# Altium project ESPedal.PrjPcb
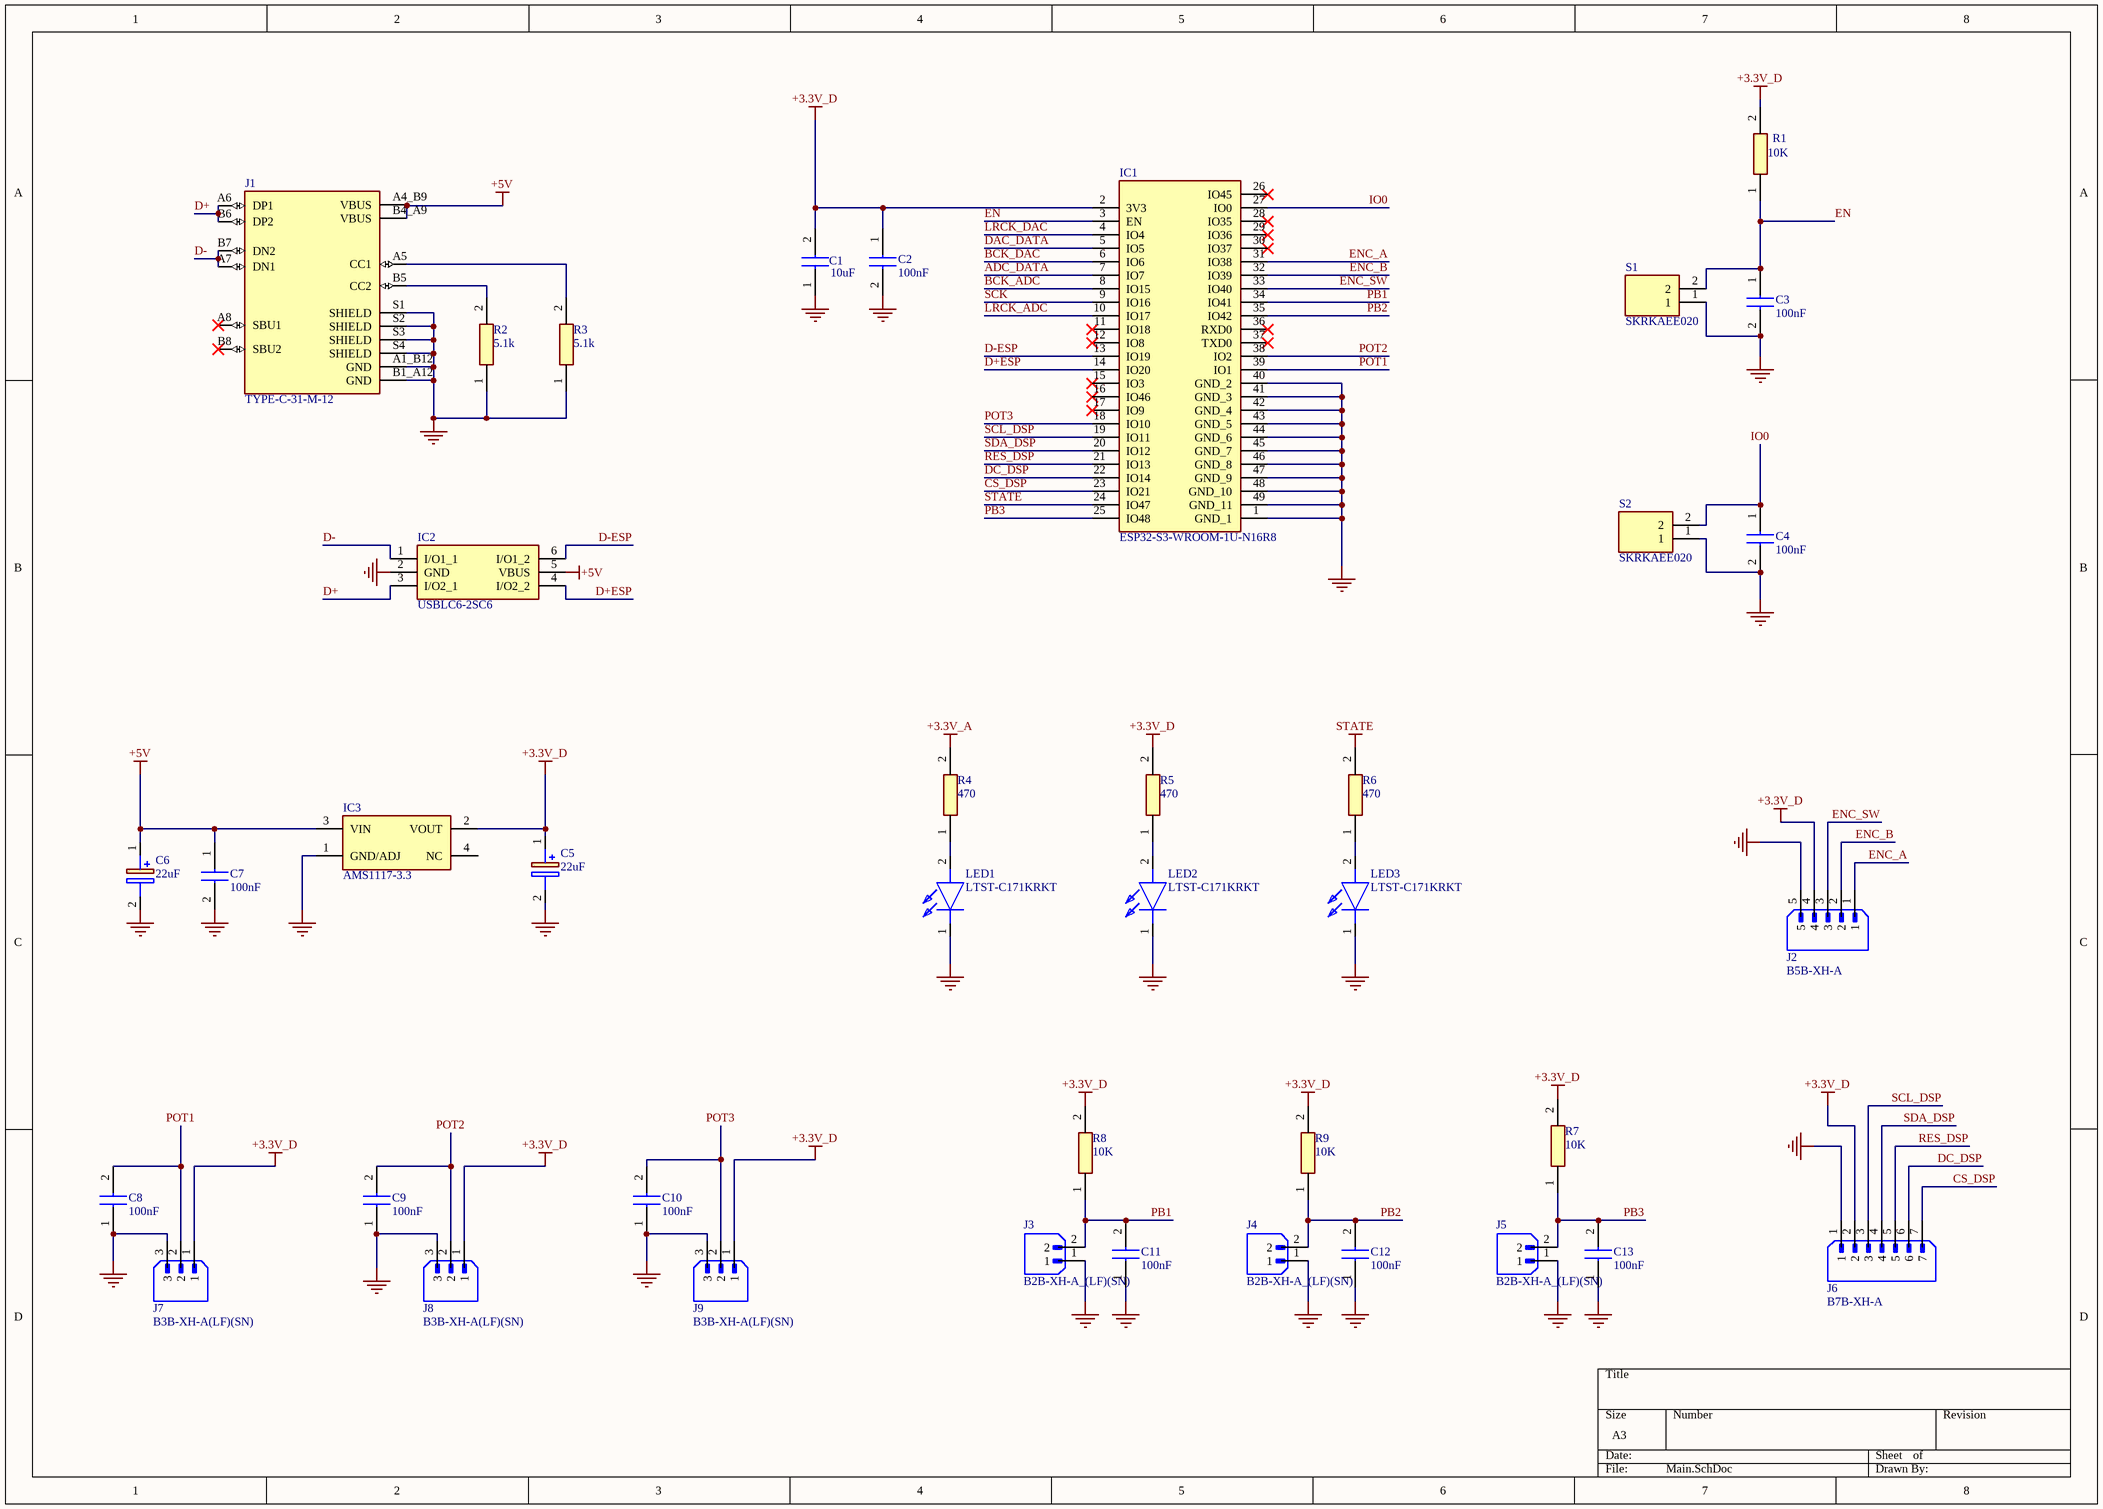
[diagram p0: Main.SchDoc]
2 sheets, 109 parts. Net scope: global (net labels, ports and power ports of the same name join across sheets).
Board file: PCB.PcbDoc
Sheets:
  Main.SchDoc
  Mixed.SchDoc

## Sheet Main.SchDoc
size A3; SheetNumber: 1; SheetTotal: 2

### Parts
C1  10uF  [CAPC3216X180N]
C2  100nF  [CAPC1608X90N]
C3  100nF  [CAPC1608X90N]
C4  100nF  [CAPC1608X90N]
C5  22uF  [CAPAE430X590N]
C6  22uF  [CAPAE430X590N]
C7  100nF  [CAPC1608X90N]
C8  100nF  [CAPC1608X90N]
C9  100nF  [CAPC1608X90N]
C10  100nF  [CAPC1608X90N]
C11  100nF  [CAPC1608X90N]
C12  100nF  [CAPC1608X90N]
C13  100nF  [CAPC1608X90N]
IC1  ESP32-S3-WROOM-1U-N16R8  [ESP32S3WROOM1UN16R8]
IC2  USBLC6-2SC6  [SOT95P280X145-6N]
IC3  AMS1117-3.3  [SOT229P700X180-4N]
J1  TYPE-C-31-M-12  [HRO_TYPE-C-31-M-12]
J2  B5B-XH-A  [JST_B5B-XH-A]  (no BOM)
J3  B2B-XH-A_(LF)(SN)  [JST_B2B-XH-A_(LF)(SN)]  (no BOM)
J4  B2B-XH-A_(LF)(SN)  [JST_B2B-XH-A_(LF)(SN)]  (no BOM)
J5  B2B-XH-A_(LF)(SN)  [JST_B2B-XH-A_(LF)(SN)]  (no BOM)
J6  B7B-XH-A  [JST_B7B-XH-A]  (no BOM)
J7  B3B-XH-A(LF)(SN)  [JST_B3B-XH-A(LF)(SN)]  (no BOM)
J8  B3B-XH-A(LF)(SN)  [JST_B3B-XH-A(LF)(SN)]  (no BOM)
J9  B3B-XH-A(LF)(SN)  [JST_B3B-XH-A(LF)(SN)]  (no BOM)
LED1  LTST-C171KRKT  [LEDM2012X90N]
LED2  LTST-C171KRKT  [LEDM2012X90N]
LED3  LTST-C171KRKT  [LEDM2012X90N]
R1  10K  [RESC2012X60N]
R2  5.1k  [ERA6AEB101V]
R3  5.1k  [ERA6AEB101V]
R4  470  [ERA3AEB101V]
R5  470  [ERA3AEB101V]
R6  470  [ERA3AEB101V]
R7  10K  [RESC2012X60N]
R8  10K  [RESC2012X60N]
R9  10K  [RESC2012X60N]
S1  SKRKAEE020  [SKRKAEE020]
S2  SKRKAEE020  [SKRKAEE020]

### Nets
+3.3V_A: R4.2
+3.3V_D: C1.2 C2.1 C5.1(+) IC1.2(3V3) IC3.2(VOUT) J2.4 J6.2 J7.1 J8.1 J9.1 R1.2 R5.2 R7.2 R8.2 R9.2
+5V: C6.1(+) C7.1 IC2.5(VBUS) IC3.3(VIN) J1.A4_B9(VBUS) J1.B4_A9(VBUS)
GND: C1.1 C2.2 C3.2 C4.2 C5.2(-) C6.2(-) C7.2 C8.1 C9.1 C10.1 C11.1 C12.1 C13.1 IC1.1(GND_1) IC1.40(GND_2) IC1.41(GND_3) IC1.42(GND_4) IC1.43(GND_5) IC1.44(GND_6) IC1.45(GND_7) IC1.46(GND_8) IC1.47(GND_9) IC1.48(GND_10) IC1.49(GND_11) IC2.2(GND) IC3.1(GND/ADJ) J1.A1_B12(GND) J1.B1_A12(GND) J1.S1(SHIELD) J1.S2(SHIELD) J1.S3(SHIELD) J1.S4(SHIELD) J2.5 J3.1 J4.1 J5.1 J6.1 J7.3 J8.3 J9.3 LED1.1(K) LED2.1(K) LED3.1(K) R2.1 R3.1 S1.1 S2.1
STATE: IC1.24(IO47) R6.2
ADC_DATA: IC1.7(IO7)
BCK_ADC: IC1.8(IO15)
BCK_DAC: IC1.6(IO6)
CS_DSP: IC1.23(IO21) J6.7
D+: IC2.3(I/O2_1) J1.A6(DP1) J1.B6(DP2)
D+ESP: IC1.14(IO20) IC2.4(I/O2_2)
D-: IC2.1(I/O1_1) J1.A7(DN1) J1.B7(DN2)
D-ESP: IC1.13(IO19) IC2.6(I/O1_2)
DAC_DATA: IC1.5(IO5)
DC_DSP: IC1.22(IO14) J6.6
EN: C3.1 IC1.3(EN) R1.1 S1.2
ENC_A: IC1.31(IO38) J2.1
ENC_B: IC1.32(IO39) J2.2
ENC_SW: IC1.33(IO40) J2.3
IO0: C4.1 IC1.27(IO0) S2.2
LRCK_ADC: IC1.10(IO17)
LRCK_DAC: IC1.4(IO4)
PB1: C11.2 IC1.34(IO41) J3.2 R8.1
PB2: C12.2 IC1.35(IO42) J4.2 R9.1
PB3: C13.2 IC1.25(IO48) J5.2 R7.1
POT1: C8.2 IC1.39(IO1) J7.2
POT2: C9.2 IC1.38(IO2) J8.2
POT3: C10.2 IC1.18(IO10) J9.2
RES_DSP: IC1.21(IO13) J6.5
SCK: IC1.9(IO16)
SCL_DSP: IC1.19(IO11) J6.3
SDA_DSP: IC1.20(IO12) J6.4
NetJ1_A5: J1.A5(CC1) R3.2
NetJ1_B5: J1.B5(CC2) R2.2
NetLED1_2: LED1.2(A) R4.1
NetLED2_2: LED2.2(A) R5.1
NetLED3_2: LED3.2(A) R6.1

Not connected (* = marked no-connect by the designer): IC1 11(IO18)* 12(IO8)* 15(IO3)* 16(IO46)* 17(IO9)* 26(IO45)* 28(IO35)* 29(IO36)* 30(IO37)* 36(RXD0)* 37(TXD0)*; IC3 4(NC); J1 A8(SBU1)* B8(SBU2)*

### Library data of the parts
C1 = CL31A106KAHNNNE: Capacitor; Manufacturer_Name: SAMSUNG; Datasheet Link: https://datasheet.datasheetarchive.com/originals/distributors/Datasheets_SAMA/8c86add0e95aa125c91e23e767429ce6.pdf; Height: 1.8mm; Manufacturer_Part_Number: CL31A106KAHNNNE; Mouser Part Number: 187-CL31A106KAHNNNE; Mouser Price/Stock: https://www.mouser.co.uk/ProductDetail/Samsung-Electro-Mechanics/CL31A106KAHNNNE?qs=349EhDEZ59rSHw4%2FqTnHBg%3D%3D; Arrow Part Number: CL31A106KAHNNNE; Arrow Price/Stock: https://www.arrow.com/en/products/cl31a106kahnnne/samsung-electro-mechanics?utm_currency=USD&region=europe
C2-C4 C7-C13 = CL10B104KC8NNNC: Capacitor; Manufacturer_Name: SAMSUNG; Datasheet Link: https://datasheet.datasheetarchive.com/originals/distributors/DKDS-19/373511.pdf; Height: 0.9mm; Manufacturer_Part_Number: CL10B104KC8NNNC; Mouser Part Number: 187-CL10B104KC8NNNC; Mouser Price/Stock: https://www.mouser.co.uk/ProductDetail/Samsung-Electro-Mechanics/CL10B104KC8NNNC?qs=%2FukktrhNKsY5bKXvqblW4Q%3D%3D; Arrow Part Number: CL10B104KC8NNNC; Arrow Price/Stock: https://www.arrow.com/en/products/cl10b104kc8nnnc/samsung-electro-mechanics?utm_currency=USD&region=europe
C5 C6 = RVT1C220M0405: Capacitor Polarised; Manufacturer_Name: ROQANG; Datasheet Link: https://wmsc.lcsc.com/wmsc/upload/file/pdf/v2/lcsc/2304140030_CX-Dongguan-Chengxing-Elec-RVT1C220M0405_C81984.pdf; Height: 5.9mm; Manufacturer_Part_Number: RVT1C220M0405
IC1 = ESP32-S3-WROOM-1U-N16R8: Integrated Circuit; Manufacturer_Name: Espressif Systems; Datasheet Link: https://www.espressif.com/sites/default/files/documentation/esp32-s3-wroom-1_wroom-1u_datasheet_en.pdf; Height: 3.35mm; Manufacturer_Part_Number: ESP32-S3-WROOM-1U-N16R8; Mouser Part Number: 356-ESP32S3WM1UN16R8; Mouser Price/Stock: https://www.mouser.co.uk/ProductDetail/Espressif-Systems/ESP32-S3-WROOM-1U-N16R8?qs=Li%252BoUPsLEns6V0Pr5KRJtw%3D%3D
IC2 = USBLC6-2SC6: Integrated Circuit; Manufacturer_Name: STMicroelectronics; Datasheet Link: https://www.st.com/resource/en/datasheet/usblc6-2.pdf; Height: 1.45mm; Manufacturer_Part_Number: USBLC6-2SC6; Mouser Part Number: 511-USBLC6-2SC6; Mouser Price/Stock: https://www.mouser.co.uk/ProductDetail/STMicroelectronics/USBLC6-2SC6?qs=po45yt2pPpu%2FhNIlwQdTlg%3D%3D; Arrow Part Number: USBLC6-2SC6; Arrow Price/Stock: https://www.arrow.com/en/products/usblc6-2sc6/stmicroelectronics.html?utm_currency=USD&region=nac
IC3 = AMS1117-3.3: Integrated Circuit; Manufacturer_Name: Advanced; Datasheet Link: https://datasheet.datasheetarchive.com/originals/distributors/Datasheets-28/DSA-550594.pdf; Height: 1.8mm; Manufacturer_Part_Number: AMS1117-3.3
J1 = TYPE-C-31-M-12: USB Connectors 24 Receptacle 1 8.94*7.3mm RoHS; MF: HRO Electronics Co., Ltd.; SnapEDA_Link: https://www.snapeda.com/parts/TYPE-C-31-M-12/HRO+Electronics+Co.%252C+Ltd./view-part/?ref=snap; Package: Package; Value: *; MP: TYPE-C-31-M-12; Check_prices: https://www.snapeda.com/parts/TYPE-C-31-M-12/HRO+Electronics+Co.%252C+Ltd./view-part/?ref=eda; Manufacturer_Part_Number: TYPE-C-31-M-12
J2 = B5B-XH-A: Connector Header Through Hole 5 position 0.098 (2.50mm); MF: JST Sales; SnapEDA_Link: https://www.snapeda.com/parts/B5B-XH-A/JST+Sales+America+Inc./view-part/?ref=snap; Package: None; Value: *; MP: B5B-XH-A; Check_prices: https://www.snapeda.com/parts/B5B-XH-A/JST+Sales+America+Inc./view-part/?ref=eda
J3-J5 = B2B-XH-A_(LF)(SN): Connector Header Through Hole 2 position 0.098 (2.50mm); MF: JST Sales; MP: B2B-XH-A (LF)(SN); SnapEDA_Link: https://www.snapeda.com/parts/B2B-XH-A%20(LF)(SN)/JST+Sales+America+Inc./view-part/?ref=snap; Package: None; Value: *; Check_prices: https://www.snapeda.com/parts/B2B-XH-A%20(LF)(SN)/JST+Sales+America+Inc./view-part/?ref=eda
J6 = B7B-XH-A: Connector Header Through Hole 7 position 0.098 (2.50mm); MF: JST Sales; SnapEDA_Link: https://www.snapeda.com/parts/B7B-XH-A/JST+Sales+America+Inc./view-part/?ref=snap; Package: None; Value: *; MP: B7B-XH-A; Check_prices: https://www.snapeda.com/parts/B7B-XH-A/JST+Sales+America+Inc./view-part/?ref=eda
J7-J9 = B3B-XH-A(LF)(SN): Connector Header Through Hole 3 position 0.098 (2.50mm); MF: JST Sales; SnapEDA_Link: https://www.snapeda.com/parts/B3B-XH-A(LF)(SN)/JST/view-part/?ref=snap; Package: None; Value: *; MP: B3B-XH-A(LF)(SN); Check_prices: https://www.snapeda.com/parts/B3B-XH-A(LF)(SN)/JST/view-part/?ref=eda
LED1-LED3 = LTST-C171KRKT: LED; Manufacturer_Name: Lite-On; Datasheet Link: http://www.mouser.com/datasheet/2/239/Lite-On-LTST-C171KRKT-1175280.pdf; Height: 0.9mm; Manufacturer_Part_Number: LTST-C171KRKT; Mouser Part Number: 859-LTST-C171KRKT; Mouser Price/Stock: https://www.mouser.co.uk/ProductDetail/LITEON/LTST-C171KRKT?qs=5XMAZBf2SiSTcAb1f5vDzw%3D%3D; Arrow Part Number: LTST-C171KRKT; Arrow Price/Stock: https://www.arrow.com/en/products/ltst-c171krkt/lite-on-technology?utm_currency=USD&region=nac
R1 R7-R9 = AC0805JR-0710KL: Resistor; Manufacturer_Name: Yageo Group; Datasheet Link: https://www.yageo.com/upload/media/product/productsearch/datasheet/rchip/PYu-AC_51_RoHS_L_10.pdf; Height: 0.6mm; Manufacturer_Part_Number: AC0805JR-0710KL; Mouser Part Number: 603-AC0805JR-0710KL; Mouser Price/Stock: https://www.mouser.co.uk/ProductDetail/YAGEO/AC0805JR-0710KL?qs=ygRr%2Ftkhtes%252BG%252B8d7tcP9w%3D%3D
R2 R3 = ERA-6AED512V: Resistor; Manufacturer_Name: Panasonic; Datasheet Link: https://industrial.panasonic.com/cdbs/www-data/pdf/RDM0000/AOA0000C307.pdf; Height: 0.6mm; Manufacturer_Part_Number: ERA-6AED512V; Mouser Part Number: 667-ERA-6AED512V; Mouser Price/Stock: https://www.mouser.co.uk/ProductDetail/Panasonic/ERA-6AED512V?qs=MNPzkKEzRtSyMhgZIjuV%252BA%3D%3D; Arrow Part Number: ERA-6AED512V; Arrow Price/Stock: https://www.arrow.com/en/products/era-6aed512v/panasonic?region=nac
R4-R6 = ERA-3AEB471V: Resistor; Manufacturer_Name: Panasonic; Datasheet Link: https://industrial.panasonic.com/cdbs/www-data/pdf/RDM0000/AOA0000C307.pdf; Height: 0.55mm; Manufacturer_Part_Number: ERA-3AEB471V; Mouser Part Number: 667-ERA-3AEB471V; Mouser Price/Stock: https://www.mouser.co.uk/ProductDetail/Panasonic/ERA-3AEB471V?qs=1VWA5LkbEaqH3cm2W5TUkw%3D%3D; Arrow Part Number: ERA-3AEB471V; Arrow Price/Stock: https://www.arrow.com/en/products/era3aeb471v/panasonic
S1 S2 = SKRKAEE020: Switch; Manufacturer_Name: ALPS Electric; Datasheet Link: http://www.alps.com/prod/info/J/HTML/Tact/SurfaceMount/SKRK/SKRKAEE020.html; Height: 2mm; Manufacturer_Part_Number: SKRKAEE020; Mouser Part Number: 688-SKRKAEE020; Mouser Price/Stock: https://www.mouser.co.uk/ProductDetail/Alps-Alpine/SKRKAEE020?qs=MrosSN5%252BUQW89XjXIp8Ugw%3D%3D

## Sheet Mixed.SchDoc
size A3; SheetNumber: 2; SheetTotal: 2
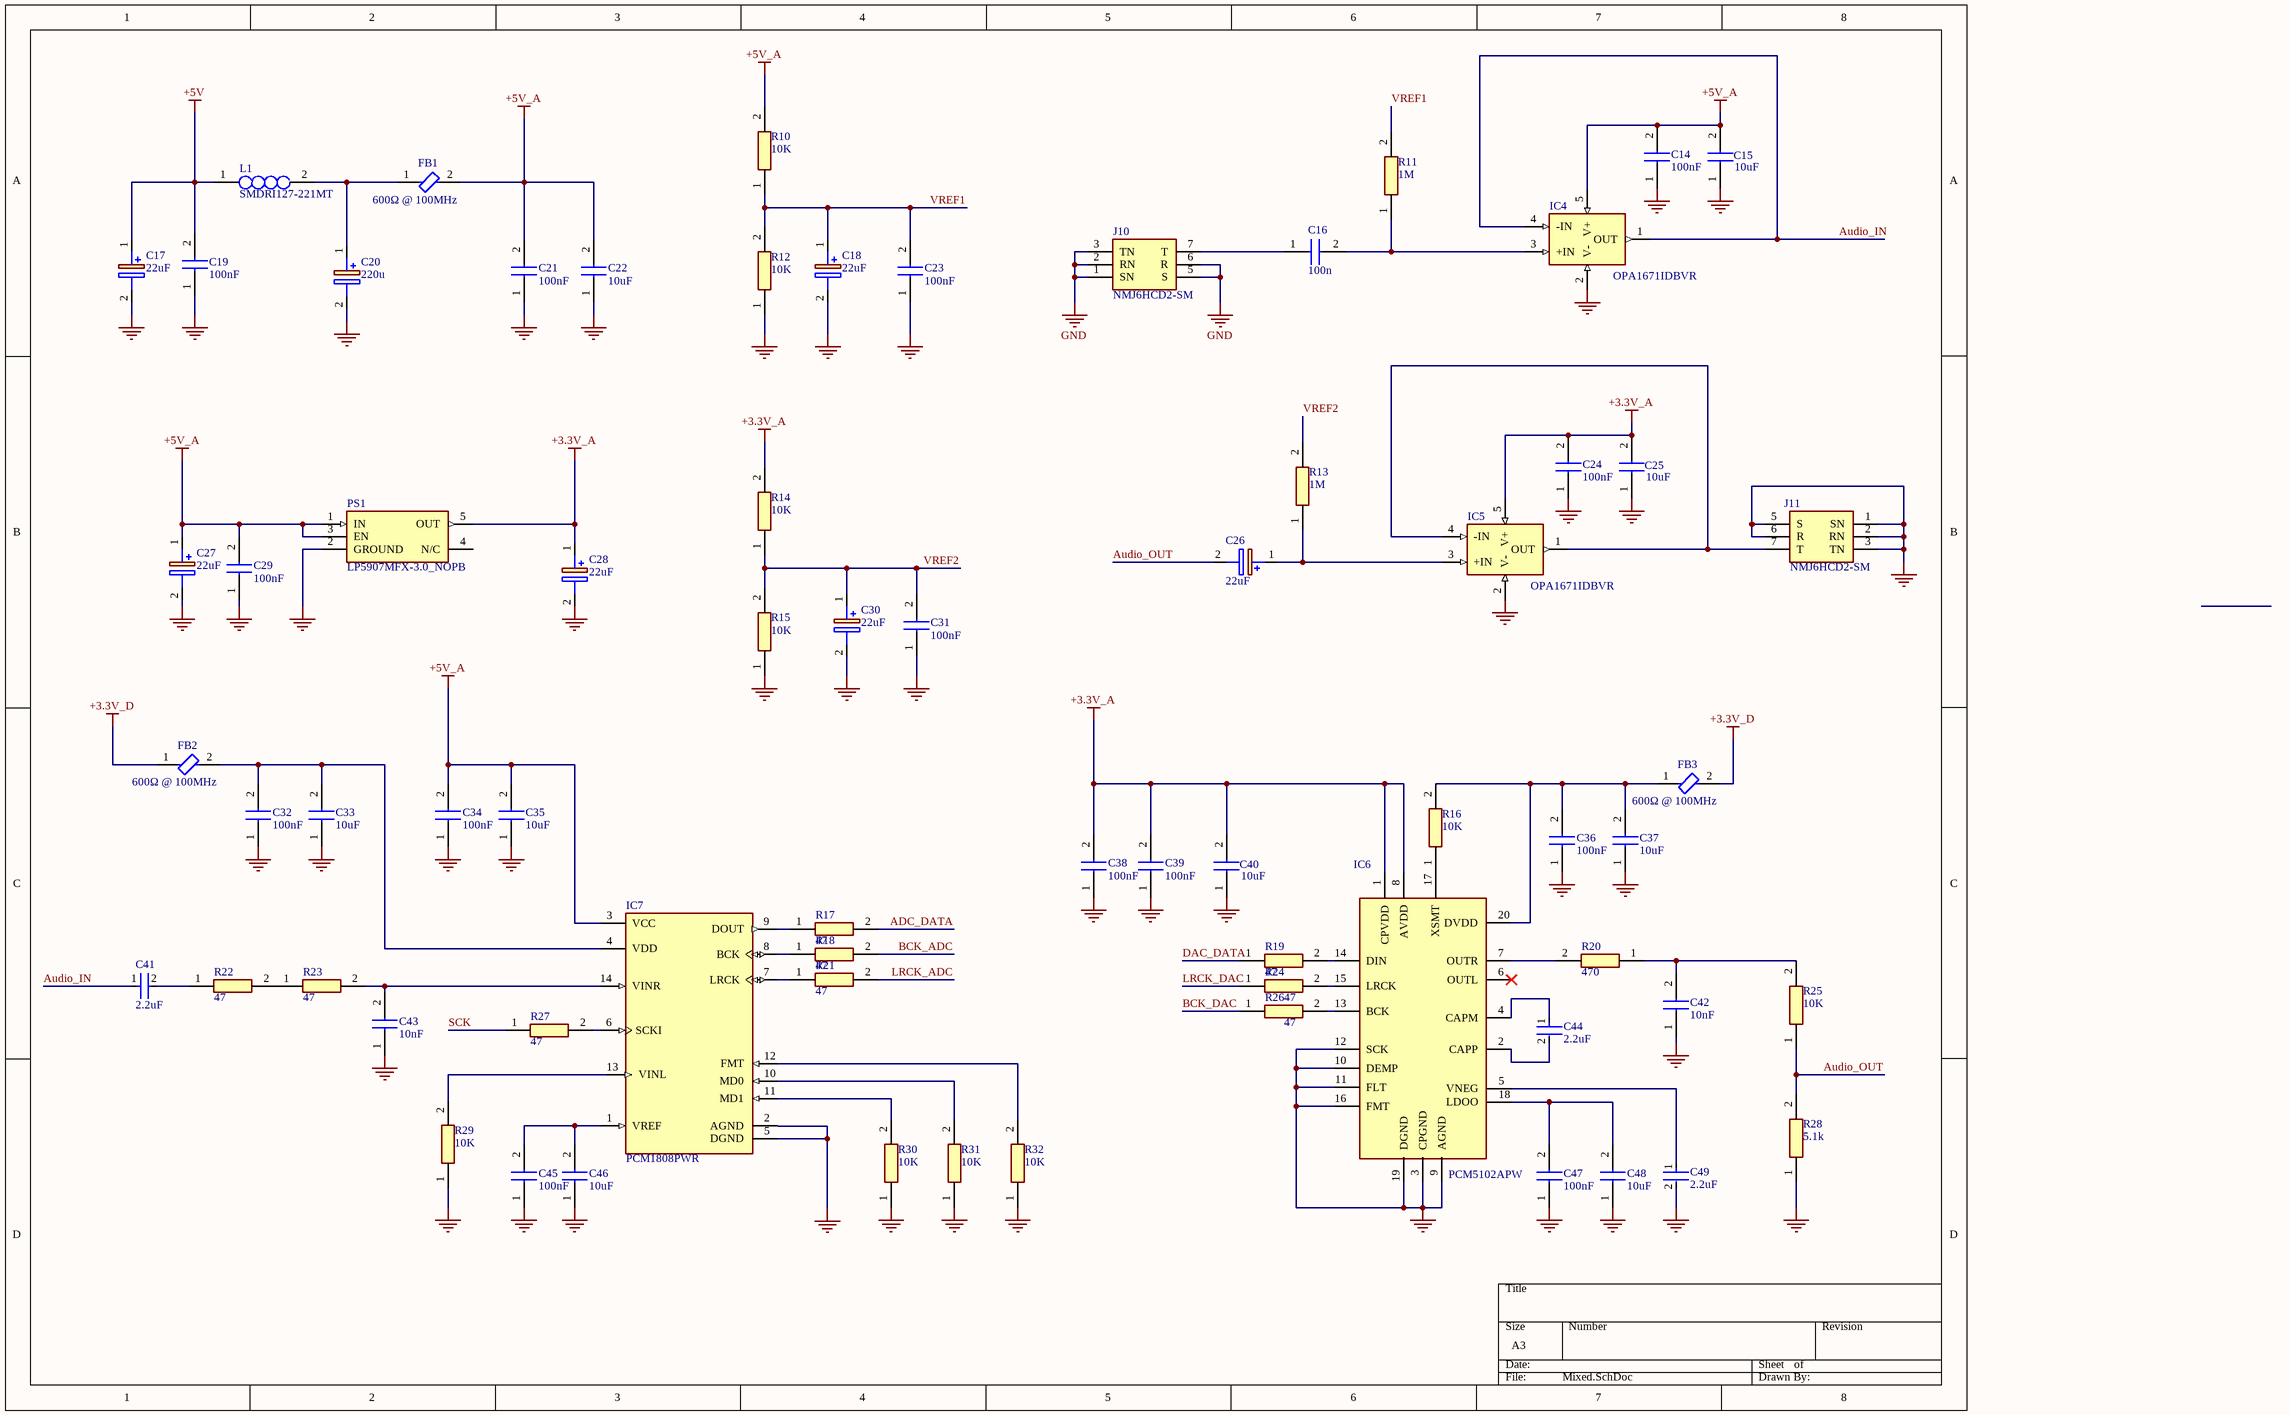
[diagram p1: Mixed.SchDoc]

### Parts
C14  100nF  [CAPC1608X90N]
C15  10uF  [CAPC3216X180N]
C16  100n  [ECHU_G3_18]
C17  22uF  [CAPAE430X590N]
C18  22uF  [CAPAE430X590N]
C19  100nF  [CAPC1608X90N]
C20  220u  [CAPAE1030X1050N]
C21  100nF  [CAPC1608X90N]
C22  10uF  [CAPC3216X180N]
C23  100nF  [CAPC1608X90N]
C24  100nF  [CAPC1608X90N]
C25  10uF  [CAPC3216X180N]
C26  22uF  [CAPAE430X590N]
C27  22uF  [CAPAE430X590N]
C28  22uF  [CAPAE430X590N]
C29  100nF  [CAPC1608X90N]
C30  22uF  [CAPAE430X590N]
C31  100nF  [CAPC1608X90N]
C32  100nF  [CAPC1608X90N]
C33  10uF  [CAPC3216X180N]
C34  100nF  [CAPC1608X90N]
C35  10uF  [CAPC3216X180N]
C36  100nF  [CAPC1608X90N]
C37  10uF  [CAPC3216X180N]
C38  100nF  [CAPC1608X90N]
C39  100nF  [CAPC1608X90N]
C40  10uF  [CAPC3216X180N]
C41  2.2uF  [FP-CL21-IPC_A]
C42  10nF  [CAPC2012X94N]
C43  10nF  [CAPC2012X94N]
C44  2.2uF  [FP-CL21-IPC_A]
C45  100nF  [CAPC1608X90N]
C46  10uF  [CAPC3216X180N]
C47  100nF  [CAPC1608X90N]
C48  10uF  [CAPC3216X180N]
C49  2.2uF  [FP-CL21-IPC_A]
FB1  600Ω @ 100MHz  [FP-BLM18-0_15-t0_8-IPC_A]
FB2  600Ω @ 100MHz  [FP-BLM18-0_15-t0_8-IPC_A]
FB3  600Ω @ 100MHz  [FP-BLM18-0_15-t0_8-IPC_A]
IC4  OPA1671IDBVR  [SOT95P280X145-5N]
IC5  OPA1671IDBVR  [SOT95P280X145-5N]
IC6  PCM5102APW  [SOP65P640X120-20N]
IC7  PCM1808PWR  [SOP65P640X120-14N]
J10  NMJ6HCD2-SM  [NEUTRIK_NMJ6HCD2]  (no BOM)
J11  NMJ6HCD2-SM  [NEUTRIK_NMJ6HCD2]  (no BOM)
L1  SMDRI127-221MT  [SMDRI127221MT]
PS1  LP5907MFX-3.0_NOPB  [SOT95P280X145-5N]
R10  10K  [RESC2012X60N]
R11  1M  [RESC1005X40N]
R12  10K  [RESC2012X60N]
R13  1M  [RESC1005X40N]
R14  10K  [RESC2012X60N]
R15  10K  [RESC2012X60N]
R16  10K  [RESC2012X60N]
R17  47  [RESC1608X50N]
R18  47  [RESC1608X50N]
R19  47  [RESC1608X50N]
R20  470  [ERA3AEB101V]
R21  47  [RESC1608X50N]
R22  47  [RESC1608X50N]
R23  47  [RESC1608X50N]
R24  47  [RESC1608X50N]
R25  10K  [RESC2012X60N]
R26  47  [RESC1608X50N]
R27  47  [RESC1608X50N]
R28  5.1k  [ERA6AEB101V]
R29  10K  [RESC2012X60N]
R30  10K  [RESC2012X60N]
R31  10K  [RESC2012X60N]
R32  10K  [RESC2012X60N]

### Nets
+3.3V_A: C24.2 C25.2 C28.1(+) C38.2 C39.2 C40.2 IC5.5(V+) IC6.1(CPVDD) IC6.8(AVDD) PS1.5(OUT) R14.2
+3.3V_D: FB2.1 FB3.2
+5V: C17.1(+) C19.2 L1.1(N1+)
+5V_A: C14.2 C15.2 C21.2 C22.2 C27.1(+) C29.2 C34.2 C35.2 FB1.2 IC4.5(V+) IC7.3(VCC) PS1.1(IN) PS1.3(EN) R10.2
GND: C14.1 C15.1 C17.2(-) C18.2(-) C19.1 C20.2(-) C21.1 C22.1 C23.1 C24.1 C25.1 C27.2(-) C28.2(-) C29.1 C30.2(-) C31.1 C32.1 C33.1 C34.1 C35.1 C36.1 C37.1 C38.1 C39.1 C40.1 C42.1 C43.1 C45.1 C46.1 C47.1 C48.1 C49.2 IC4.2(V-) IC5.2(V-) IC6.3(CPGND) IC6.9(AGND) IC6.10(DEMP) IC6.11(FLT) IC6.12(SCK) IC6.16(FMT) IC6.19(DGND) IC7.2(AGND) IC7.5(DGND) J10.1(SN) J10.2(RN) J10.3(TN) J10.5(S) J10.6(R) J11.1(SN) J11.2(RN) J11.3(TN) J11.5(S) J11.6(R) PS1.2(GROUND) R12.1 R15.1 R28.1 R29.1 R30.1 R31.1 R32.1
ADC_DATA: R17.2
Audio_IN: C41.1 IC4.1(OUT) IC4.4(-IN)
Audio_OUT: C26.2(-) R25.1 R28.2
BCK_ADC: R18.2
BCK_DAC: R26.1
DAC_DATA: R19.1
LRCK_ADC: R21.2
LRCK_DAC: R24.1
SCK: R27.1
VREF1: C18.1(+) C23.2 R10.1 R11.2 R12.2
VREF2: C30.1(+) C31.2 R13.2 R14.1 R15.2
NetC16_1: C16.1 J10.7(T)
NetC16_2: C16.2 IC4.3(+IN) R11.1
NetC20_1: C20.1(+) FB1.1 L1.2(N1-)
NetC26_1: C26.1(+) IC5.3(+IN) R13.1
NetC32_2: C32.2 C33.2 FB2.2 IC7.4(VDD)
NetC36_2: C36.2 C37.2 FB3.1 IC6.20(DVDD) R16.2
NetC41_2: C41.2 R22.1
NetC42_2: C42.2 R20.1 R25.2
NetC43_2: C43.2 IC7.14(VINR) R23.2
NetC44_1: C44.1 IC6.4(CAPM)
NetC44_2: C44.2 IC6.2(CAPP)
NetC45_2: C45.2 C46.2 IC7.1(VREF)
NetC47_2: C47.2 C48.2 IC6.18(LDOO)
NetC49_1: C49.1 IC6.5(VNEG)
NetIC5_1: IC5.1(OUT) IC5.4(-IN) J11.7(T)
NetIC6_7: IC6.7(OUTR) R20.2
NetIC6_13: IC6.13(BCK) R26.2
NetIC6_14: IC6.14(DIN) R19.2
NetIC6_15: IC6.15(LRCK) R24.2
NetIC6_17: IC6.17(XSMT) R16.1
NetIC7_6: IC7.6(SCKI) R27.2
NetIC7_7: IC7.7(LRCK) R21.1
NetIC7_8: IC7.8(BCK) R18.1
NetIC7_9: IC7.9(DOUT) R17.1
NetIC7_10: IC7.10(MD0) R31.2
NetIC7_11: IC7.11(MD1) R30.2
NetIC7_12: IC7.12(FMT) R32.2
NetIC7_13: IC7.13(VINL) R29.2
NetR22_2: R22.2 R23.1

Not connected (* = marked no-connect by the designer): IC6 6(OUTL)*; PS1 4(N/C)

### Library data of the parts
C14 C19 C21 C23 C24 C29 C31 C32 C34 C36 C38 C39 C45 C47 = CL10B104KC8NNNC: Capacitor; Manufacturer_Name: SAMSUNG; Datasheet Link: https://datasheet.datasheetarchive.com/originals/distributors/DKDS-19/373511.pdf; Height: 0.9mm; Manufacturer_Part_Number: CL10B104KC8NNNC; Mouser Part Number: 187-CL10B104KC8NNNC; Mouser Price/Stock: https://www.mouser.co.uk/ProductDetail/Samsung-Electro-Mechanics/CL10B104KC8NNNC?qs=%2FukktrhNKsY5bKXvqblW4Q%3D%3D; Arrow Part Number: CL10B104KC8NNNC; Arrow Price/Stock: https://www.arrow.com/en/products/cl10b104kc8nnnc/samsung-electro-mechanics?utm_currency=USD&region=europe
C15 C22 C25 C33 C35 C37 C40 C46 C48 = CL31A106KAHNNNE: Capacitor; Manufacturer_Name: SAMSUNG; Datasheet Link: https://datasheet.datasheetarchive.com/originals/distributors/Datasheets_SAMA/8c86add0e95aa125c91e23e767429ce6.pdf; Height: 1.8mm; Manufacturer_Part_Number: CL31A106KAHNNNE; Mouser Part Number: 187-CL31A106KAHNNNE; Mouser Price/Stock: https://www.mouser.co.uk/ProductDetail/Samsung-Electro-Mechanics/CL31A106KAHNNNE?qs=349EhDEZ59rSHw4%2FqTnHBg%3D%3D; Arrow Part Number: CL31A106KAHNNNE; Arrow Price/Stock: https://www.arrow.com/en/products/cl31a106kahnnne/samsung-electro-mechanics?utm_currency=USD&region=europe
C16 = ECH-U1C104GX5: Capacitor; Manufacturer_Name: Panasonic; Datasheet Link: http://industrial.panasonic.com/cdbs/www-data/pdf/RDI0000/ABD0000C173.pdf; Manufacturer_Part_Number: ECH-U1C104GX5; Mouser Part Number: 667-ECH-U1C104GX5; Mouser Price/Stock: https://www.mouser.co.uk/ProductDetail/Panasonic/ECH-U1C104GX5?qs=b%252BB9euYP3EMEWVbLst4WHA%3D%3D; Arrow Part Number: ECH-U1C104GX5; Arrow Price/Stock: https://www.arrow.com/en/products/echu1c104gx5/panasonic?utm_currency=USD&region=nac
C17 C18 C26-C28 C30 = RVT1C220M0405: as C5 on sheet Main; Datasheet Link: https://wmsc.lcsc.com/wmsc/upload/file/pdf/v2/lcsc/2304140030_CX-Dongguan-Chengxing-Elec-RVT1C220M0405_C81984.pdf; Height: 5.9mm; Manufacturer_Part_Number: RVT1C220M0405
C20 = UWT1H221MNL1GS: Capacitor Polarised; Manufacturer_Name: Nichicon; Datasheet Link: http://www.nichicon.co.jp/english/products/pdfs/e-uwt.pdf; Height: 10.5mm; Manufacturer_Part_Number: UWT1H221MNL1GS; Mouser Part Number: 647-UWT1H221MNL1S; Mouser Price/Stock: https://www.mouser.co.uk/ProductDetail/Nichicon/UWT1H221MNL1GS?qs=X14clCvG9QkA%252BkRMafMHPw%3D%3D; Arrow Part Number: UWT1H221MNL1GS; Arrow Price/Stock: https://www.arrow.com/en/products/uwt1h221mnl1gs/nichicon?utm_currency=USD&region=europe
C41 C44 C49 = CMP-13271-000865-1: CL21 Series 0805 2.2uF 50V ±10% Tolerance X7R Multilayer Ceramic Chip Capacitor; Manufacturer_Part_Number: CL21B225KBYNNNE
C42 C43 = 08055C103KAT2A: Capacitor; Manufacturer_Name: Kyocera AVX; Datasheet Link: http://datasheets.avx.com/X7RDielectric.pdf; Height: 0.94mm; Manufacturer_Part_Number: 08055C103KAT2A; Mouser Part Number: 581-08055C103K; Mouser Price/Stock: https://www.mouser.co.uk/ProductDetail/KYOCERA-AVX/08055C103KAT2A?qs=rjW0lv%2FNY4M71vZO8r6Lsw%3D%3D; Arrow Part Number: 08055C103KAT2A; Arrow Price/Stock: https://www.arrow.com/en/products/08055c103kat2a/avx?region=nac
FB1-FB3 = CMP-0686-00354-3: p; Manufacturer Series: BLM18E; Manufacturer_Part_Number: BLM18BD601SN1D; Number of Lines: 1; DC Resistance (DCR): 350mR; DC Current: 500mA; Tolerance: 25%; Impedance: 600R; Material: Steel; Shielding: Unshielded; Core Material: Ferrite; Package Quantity: 1; Case/Package: 0603; Length: 1.6mm; Packaging: Tape and Reel; Resistance: 350mR; REACH SVHC: No SVHC; Military Standard: Not; Contact Plating: Tin; Termination: SMD/SMT; Number of Circuits: 1; Width: 0.8mm; Test Frequency: 100MHz; Case Code (Metric): 1608; Max DC Current: 500mA; Max Operating Temperature: 125°C; Current Rating: 500mA; Series: BLM18E; Min Operating Temperature: -55°C; Frequency: 100MHz; Lead Free: Lead Free; Terminal Finish: Tin; Number of Pins: 2; Max Current Rating: 500mA; Radiation Hardening: No; Case Code (Imperial): 0603; Number of Functions: 1; Depth: 0.8mm; DC Resistance-Max: 350mR; Height: 0.8mm; RoHS Compliant: Yes
IC4 IC5 = OPA1671IDBVR: Mechanical Part; Manufacturer_Name: Texas Instruments; Datasheet Link: https://www.ti.com/lit/gpn/OPA1671; Height: 1.45mm; Manufacturer_Part_Number: OPA1671IDBVR; Mouser Part Number: 595-OPA1671IDBVR; Mouser Price/Stock: https://www.mouser.co.uk/ProductDetail/Texas-Instruments/OPA1671IDBVR?qs=XeJtXLiO41SGLYFOORSwuw%3D%3D
IC6 = PCM5102APW: Integrated Circuit; Manufacturer_Name: Texas Instruments; Manufacturer_Part_Number: PCM5102APWR; Datasheet Link: http://www.ti.com/lit/gpn/PCM5102A; Height: 1.2mm; Mouser Part Number: 595-PCM5102APW; Mouser Price/Stock: https://www.mouser.co.uk/ProductDetail/Texas-Instruments/PCM5102APW?qs=E2%2FxqS9xjzqNHu82%252Bs583Q%3D%3D; Arrow Part Number: PCM5102APW; Arrow Price/Stock: https://www.arrow.com/en/products/pcm5102apw/texas-instruments?utm_currency=USD&region=nac
IC7 = PCM1808PWR: 24-bit, 99-dB SNR, 96-kHz stereo ADC with single-ended inputs; MF: Texas Instruments; SnapEDA_Link: https://www.snapeda.com/parts/PCM1808PWR/Texas+Instruments/view-part/?ref=snap; Package: TSSOP-14 Texas Instruments; Value: *; MP: PCM1808PWR; Check_prices: https://www.snapeda.com/parts/PCM1808PWR/Texas+Instruments/view-part/?ref=eda; Manufacturer_Part_Number: PCM1808PWR; Parameter 2: *
J10 J11 = NMJ6HCD2-SM: Connector; Manufacturer_Name: Neutrik; Datasheet Link: https://www.neutrik.com/media/8582/download/st-nmj6hcd2.PDF?v=3; Height: 15.67mm; Manufacturer_Part_Number: NMJ6HCD2-SM; Mouser Part Number: 568-NMJ6HCD2-SM; Mouser Price/Stock: https://www.mouser.co.uk/ProductDetail/Neutrik/NMJ6HCD2-SM?qs=%252B86TLfaev2%252Bdu3o1dNpRRg%3D%3D
L1 = SMDRI127-221MT: Inductor; Manufacturer_Name: Shun Xiang Nuo Elec; Datasheet Link: https://datasheet.lcsc.com/szlcsc/ShunXiang-Connaught-Elec-SMDRI127-221MT_C10151.pdf; Height: 8mm; Manufacturer_Part_Number: SMDRI127-221MT
PS1 = LP5907MFX-3.0_NOPB: Power Supply; Manufacturer_Name: Texas Instruments; Manufacturer_Part_Number: LP5907MFX-3.0/NOPB; Datasheet Link: http://www.ti.com/lit/gpn/lp5907; Height: 1.45mm; Mouser Part Number: 595-LP5907MFX-3.0NPB; Mouser Price/Stock: https://www.mouser.co.uk/ProductDetail/Texas-Instruments/LP5907MFX-3.0-NOPB?qs=biyDIajrTn4AH69D%252B0PS1g%3D%3D; Arrow Part Number: LP5907MFX-3.0/NOPB; Arrow Price/Stock: https://www.arrow.com/en/products/lp5907mfx3-0-nopb/texas-instruments.html?utm_currency=USD&region=asia
R10 R12 R14-R16 R25 R29-R32 = AC0805JR-0710KL: Resistor; Manufacturer_Name: Yageo Group; Datasheet Link: https://www.yageo.com/upload/media/product/productsearch/datasheet/rchip/PYu-AC_51_RoHS_L_10.pdf; Height: 0.6mm; Manufacturer_Part_Number: AC0805JR-0710KL; Mouser Part Number: 603-AC0805JR-0710KL; Mouser Price/Stock: https://www.mouser.co.uk/ProductDetail/YAGEO/AC0805JR-0710KL?qs=ygRr%2Ftkhtes%252BG%252B8d7tcP9w%3D%3D
R11 R13 = RC0402JR-071ML: Resistor; Manufacturer_Name: Yageo Group; Datasheet Link: http://www.yageo.com/documents/recent/PYu-RC0402_51_RoHS_L_6_r.pdf; Height: 0.4mm; Manufacturer_Part_Number: RC0402JR-071ML; Mouser Part Number: 603-RC0402JR-071ML; Mouser Price/Stock: https://www.mouser.co.uk/ProductDetail/Yageo/RC0402JR-071ML/?qs=uM1JSSdPjOCNcwoUm19Cag%3D%3D; Arrow Part Number: RC0402JR-071ML; Arrow Price/Stock: https://www.arrow.com/en/products/rc0402jr-071ml/yageo
R17-R19 R21-R24 R26 R27 = CRCW060347R0FKEA: Resistor; Manufacturer_Name: Vishay; Datasheet Link: http://www.vishay.com/docs/20035/dcrcwe3.pdf; Height: 0.5mm; Manufacturer_Part_Number: CRCW060347R0FKEA; Mouser Part Number: 71-CRCW0603-47-E3; Mouser Price/Stock: https://www.mouser.co.uk/ProductDetail/Vishay-Dale/CRCW060347R0FKEA?qs=iDmGvCT5Yjyx0QVXsg7Ljw%3D%3D; Arrow Part Number: CRCW060347R0FKEA; Arrow Price/Stock: https://www.arrow.com/en/products/crcw060347r0fkea/vishay
R20 = ERA-3AEB471V: Resistor; Manufacturer_Name: Panasonic; Datasheet Link: https://industrial.panasonic.com/cdbs/www-data/pdf/RDM0000/AOA0000C307.pdf; Height: 0.55mm; Manufacturer_Part_Number: ERA-3AEB471V; Mouser Part Number: 667-ERA-3AEB471V; Mouser Price/Stock: https://www.mouser.co.uk/ProductDetail/Panasonic/ERA-3AEB471V?qs=1VWA5LkbEaqH3cm2W5TUkw%3D%3D; Arrow Part Number: ERA-3AEB471V; Arrow Price/Stock: https://www.arrow.com/en/products/era3aeb471v/panasonic
R28 = ERA-6AED512V: Resistor; Manufacturer_Name: Panasonic; Datasheet Link: https://industrial.panasonic.com/cdbs/www-data/pdf/RDM0000/AOA0000C307.pdf; Height: 0.6mm; Manufacturer_Part_Number: ERA-6AED512V; Mouser Part Number: 667-ERA-6AED512V; Mouser Price/Stock: https://www.mouser.co.uk/ProductDetail/Panasonic/ERA-6AED512V?qs=MNPzkKEzRtSyMhgZIjuV%252BA%3D%3D; Arrow Part Number: ERA-6AED512V; Arrow Price/Stock: https://www.arrow.com/en/products/era-6aed512v/panasonic?region=nac

## Nets that join several sheets
+3.3V_A: Main (R4.2), Mixed (11 pins)
+3.3V_D: Main (15 pins), Mixed (FB2.1 FB3.2)
+5V: Main (6 pins), Mixed (C17.1 C19.2 L1.1)
GND: Main (47 pins), Mixed (61 pins)
ADC_DATA: Main (IC1.7), Mixed (R17.2)
BCK_ADC: Main (IC1.8), Mixed (R18.2)
BCK_DAC: Main (IC1.6), Mixed (R26.1)
DAC_DATA: Main (IC1.5), Mixed (R19.1)
LRCK_ADC: Main (IC1.10), Mixed (R21.2)
LRCK_DAC: Main (IC1.4), Mixed (R24.1)
SCK: Main (IC1.9), Mixed (R27.1)